# EAGLE schematic waveshaper (EAGLE 9.5.2)
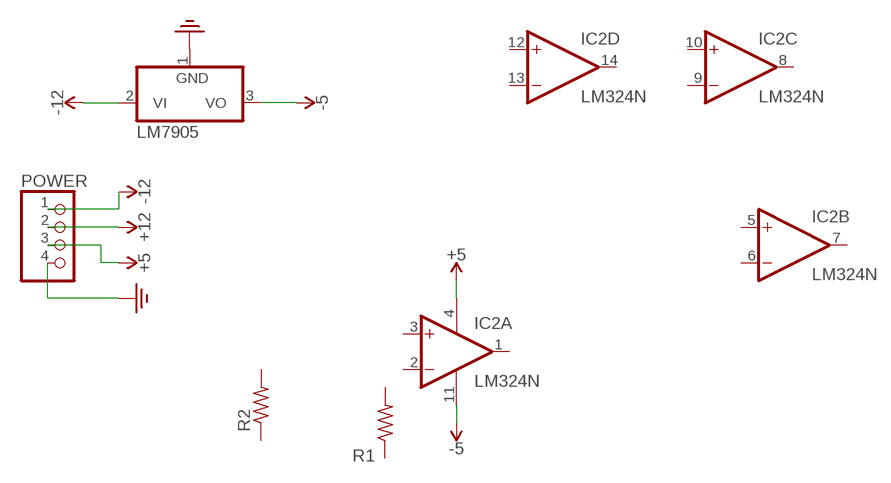
[diagram p0: schematic, sheet 1]

## Parts
IC2  LM324N  [DIL14]
LM7905  7905T  [TO220H]
POWER  PINHD-1X4  [1X04]
R1  R-US_0207/12  [0207/12]
R2  R-US_0207/12  [0207/12]

## Nets
3.3V: LM7905.1(GND) POWER.4 ; supply symbol labelled GND2
VDD: IC2.4(P:V+) IC2.11(P:V-) LM7905.2(VI) LM7905.3(VO) POWER.1 POWER.2 POWER.3 ; supply symbol labelled -12, -5, +12, +5
Unconnected: IC2.1(A:OUT) IC2.2(A:-IN) IC2.3(A:+IN) IC2.5(B:+IN) IC2.6(B:-IN) IC2.7(B:OUT) IC2.8(C:OUT) IC2.9(C:-IN) IC2.10(C:+IN) IC2.12(D:+IN) IC2.13(D:-IN) IC2.14(D:OUT) R1.1 R1.2 R2.1 R2.2

## Library data of the parts
IC2 = linear:LM324: OP AMP
LM7905 = linear:79*: Negative VOLTAGE REGULATOR
POWER = pinhead:PINHD-1X4: PIN HEADER
R1 R2 = adafruit:R-US_: RESISTOR, American symbol